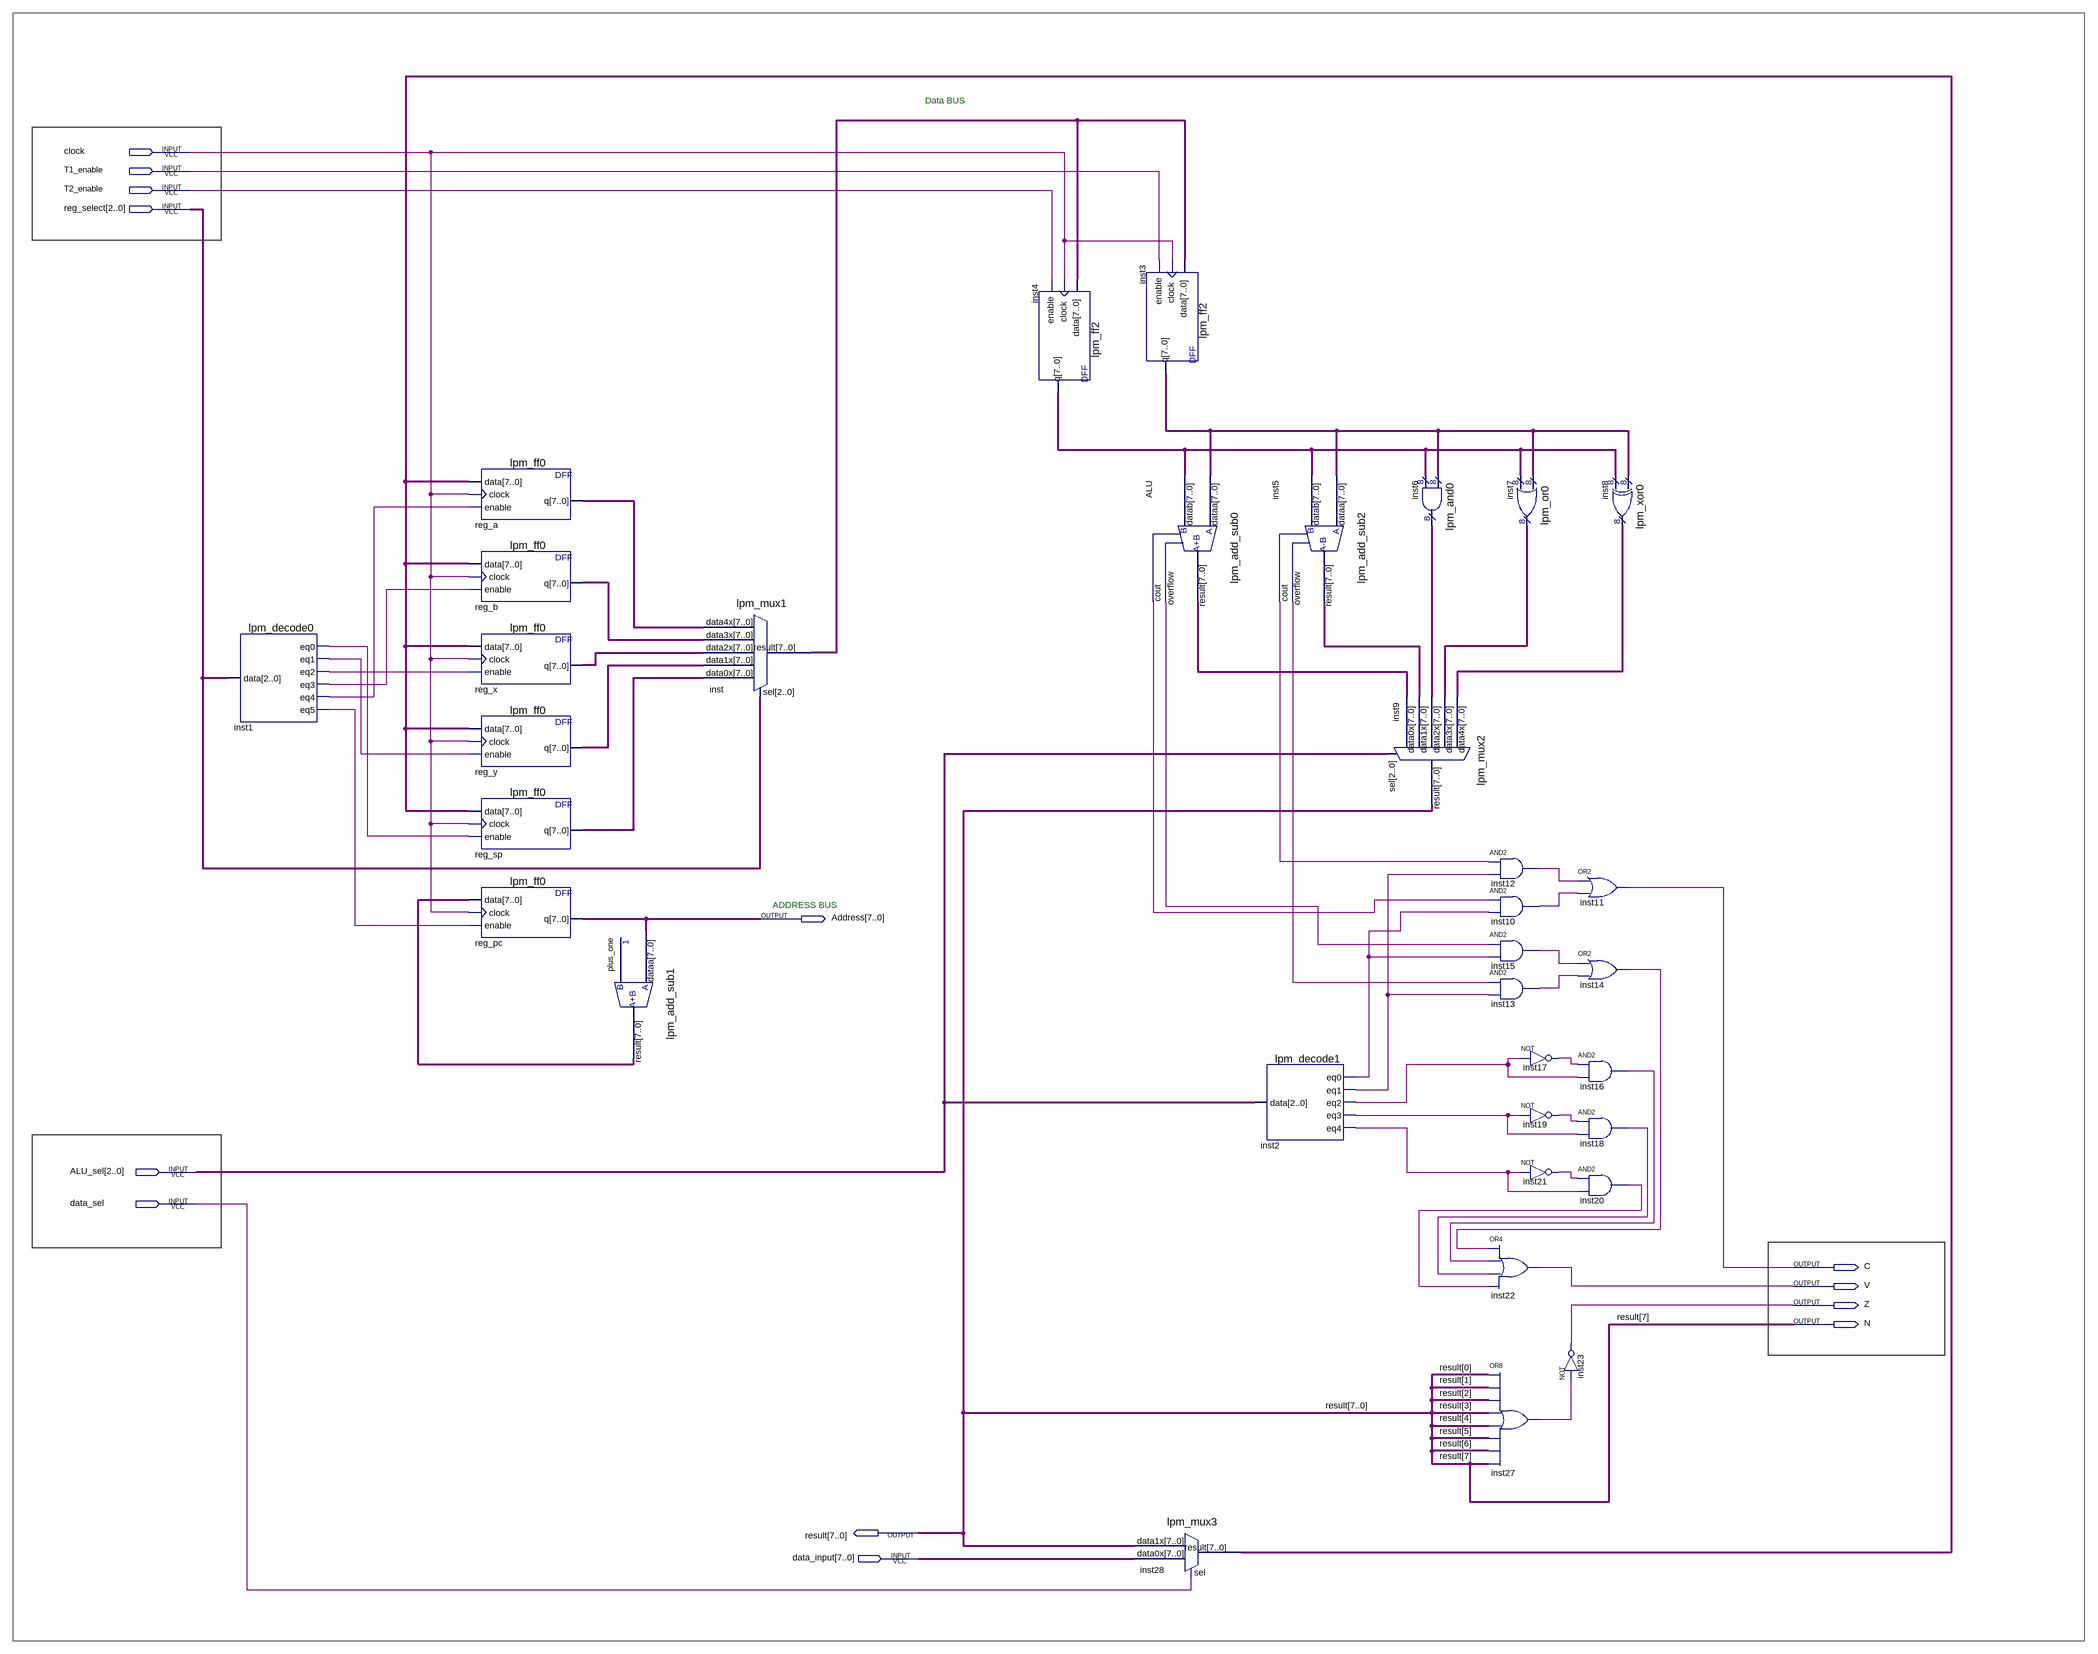
[diagram p0: schematic sheet]
// Quartus schematic Lab_3.bdf as structural Verilog: 34 symbols, 13 pins
module Lab_3 (
  input  clock,
  input  T1_enable,
  input  T2_enable,
  input  [2:0] reg_select,
  input  [2:0] ALU_sel,
  input  data_sel,
  input  [7:0] data_input,
  output [7:0] Address,
  output C,
  output V,
  output Z,
  output N,
  output [7:0] result
);

  wire ALU_cout, ALU_overflow, inst1_eq0, inst1_eq1, inst1_eq2, inst1_eq3, inst1_eq4, inst1_eq5, inst2_eq0,
       inst2_eq1, inst2_eq2, inst2_eq3, inst2_eq4, inst5_cout, inst5_overflow, inst10_out, inst12_out,
       inst13_out, inst14_out, inst15_out, inst16_out, inst17_out, inst18_out, inst19_out, inst20_out,
       inst21_out, inst27_out;
  wire [7:0] ALU_result, inst3_q, inst4_q, inst5_result, inst6_result, inst7_result, inst8_result,
       inst28_result, inst_result, plus_one_result, reg_a_q, reg_b_q, reg_sp_q, reg_x_q, reg_y_q;

  lpm_decode0 inst1 (
    .data(reg_select), .eq0(inst1_eq0), .eq1(inst1_eq1), .eq2(inst1_eq2), .eq3(inst1_eq3), .eq4(inst1_eq4),
    .eq5(inst1_eq5));
  lpm_ff0 reg_a (.data(inst28_result), .clock(clock), .enable(inst1_eq4), .q(reg_a_q));
  lpm_ff0 reg_b (.data(inst28_result), .clock(clock), .enable(inst1_eq3), .q(reg_b_q));
  lpm_ff0 reg_x (.data(inst28_result), .clock(clock), .enable(inst1_eq2), .q(reg_x_q));
  lpm_ff0 reg_y (.data(inst28_result), .clock(clock), .enable(inst1_eq1), .q(reg_y_q));
  lpm_ff0 reg_sp (.data(inst28_result), .clock(clock), .enable(inst1_eq0), .q(reg_sp_q));
  lpm_ff0 reg_pc (.data(plus_one_result), .clock(clock), .enable(inst1_eq5), .q(Address));
  lpm_add_sub1 plus_one (.dataa(Address), .result(plus_one_result));
  lpm_mux1 inst (
    .data4x(reg_a_q), .data3x(reg_b_q), .data2x(reg_x_q), .data1x(reg_y_q), .data0x(reg_sp_q),
    .sel(reg_select), .result(inst_result));
  lpm_ff2 inst4 (.data(inst_result), .clock(clock), .enable(T2_enable), .q(inst4_q));
  lpm_ff2 inst3 (.data(inst_result), .clock(clock), .enable(T1_enable), .q(inst3_q));
  lpm_add_sub0 ALU (.dataa(inst3_q), .datab(inst4_q), .result(ALU_result), .overflow(ALU_overflow), .cout(ALU_cout));
  lpm_mux3 inst28 (.data1x({N, result[6:0]}), .data0x(data_input), .sel(data_sel), .result(inst28_result));
  lpm_decode1 inst2 (
    .data(ALU_sel), .eq0(inst2_eq0), .eq1(inst2_eq1), .eq2(inst2_eq2), .eq3(inst2_eq3), .eq4(inst2_eq4));
  lpm_add_sub2 inst5 (
    .dataa(inst3_q), .datab(inst4_q), .result(inst5_result), .overflow(inst5_overflow), .cout(inst5_cout));
  lpm_and0 inst6 (.data0x(inst3_q), .data1x(inst4_q), .result(inst6_result));
  lpm_mux2 inst9 (
    .data4x(inst8_result), .data3x(inst7_result), .data2x(inst6_result), .data1x(inst5_result),
    .data0x(ALU_result), .sel(ALU_sel), .result({N, result[6:0]}));
  lpm_or0 inst7 (.data0x(inst3_q), .data1x(inst4_q), .result(inst7_result));
  and inst12 (inst12_out, inst5_cout, inst2_eq1);
  and inst10 (inst10_out, ALU_cout, inst2_eq0);
  and inst15 (inst15_out, ALU_overflow, inst2_eq0);
  and inst13 (inst13_out, inst5_overflow, inst2_eq1);
  or inst22 (V, inst14_out, inst16_out, inst18_out, inst20_out);
  or inst27 (inst27_out, result[0], result[1], result[2], result[3], result[4], result[5], result[6], N);
  not inst17 (inst17_out, inst2_eq2);
  not inst19 (inst19_out, inst2_eq3);
  not inst21 (inst21_out, inst2_eq4);
  not inst23 (Z, inst27_out);
  lpm_xor0 inst8 (.data0x(inst3_q), .data1x(inst4_q), .result(inst8_result));
  or inst11 (C, inst12_out, inst10_out);
  or inst14 (inst14_out, inst15_out, inst13_out);
  and inst16 (inst16_out, inst17_out, inst2_eq2);
  and inst18 (inst18_out, inst19_out, inst2_eq3);
  and inst20 (inst20_out, inst21_out, inst2_eq4);

  assign result[7] = N;

  // Notes on the sheet:
  //   Data BUS
  //   ADDRESS BUS
endmodule
